# EAGLE schematic basic differential sensor (EAGLE 5.03)
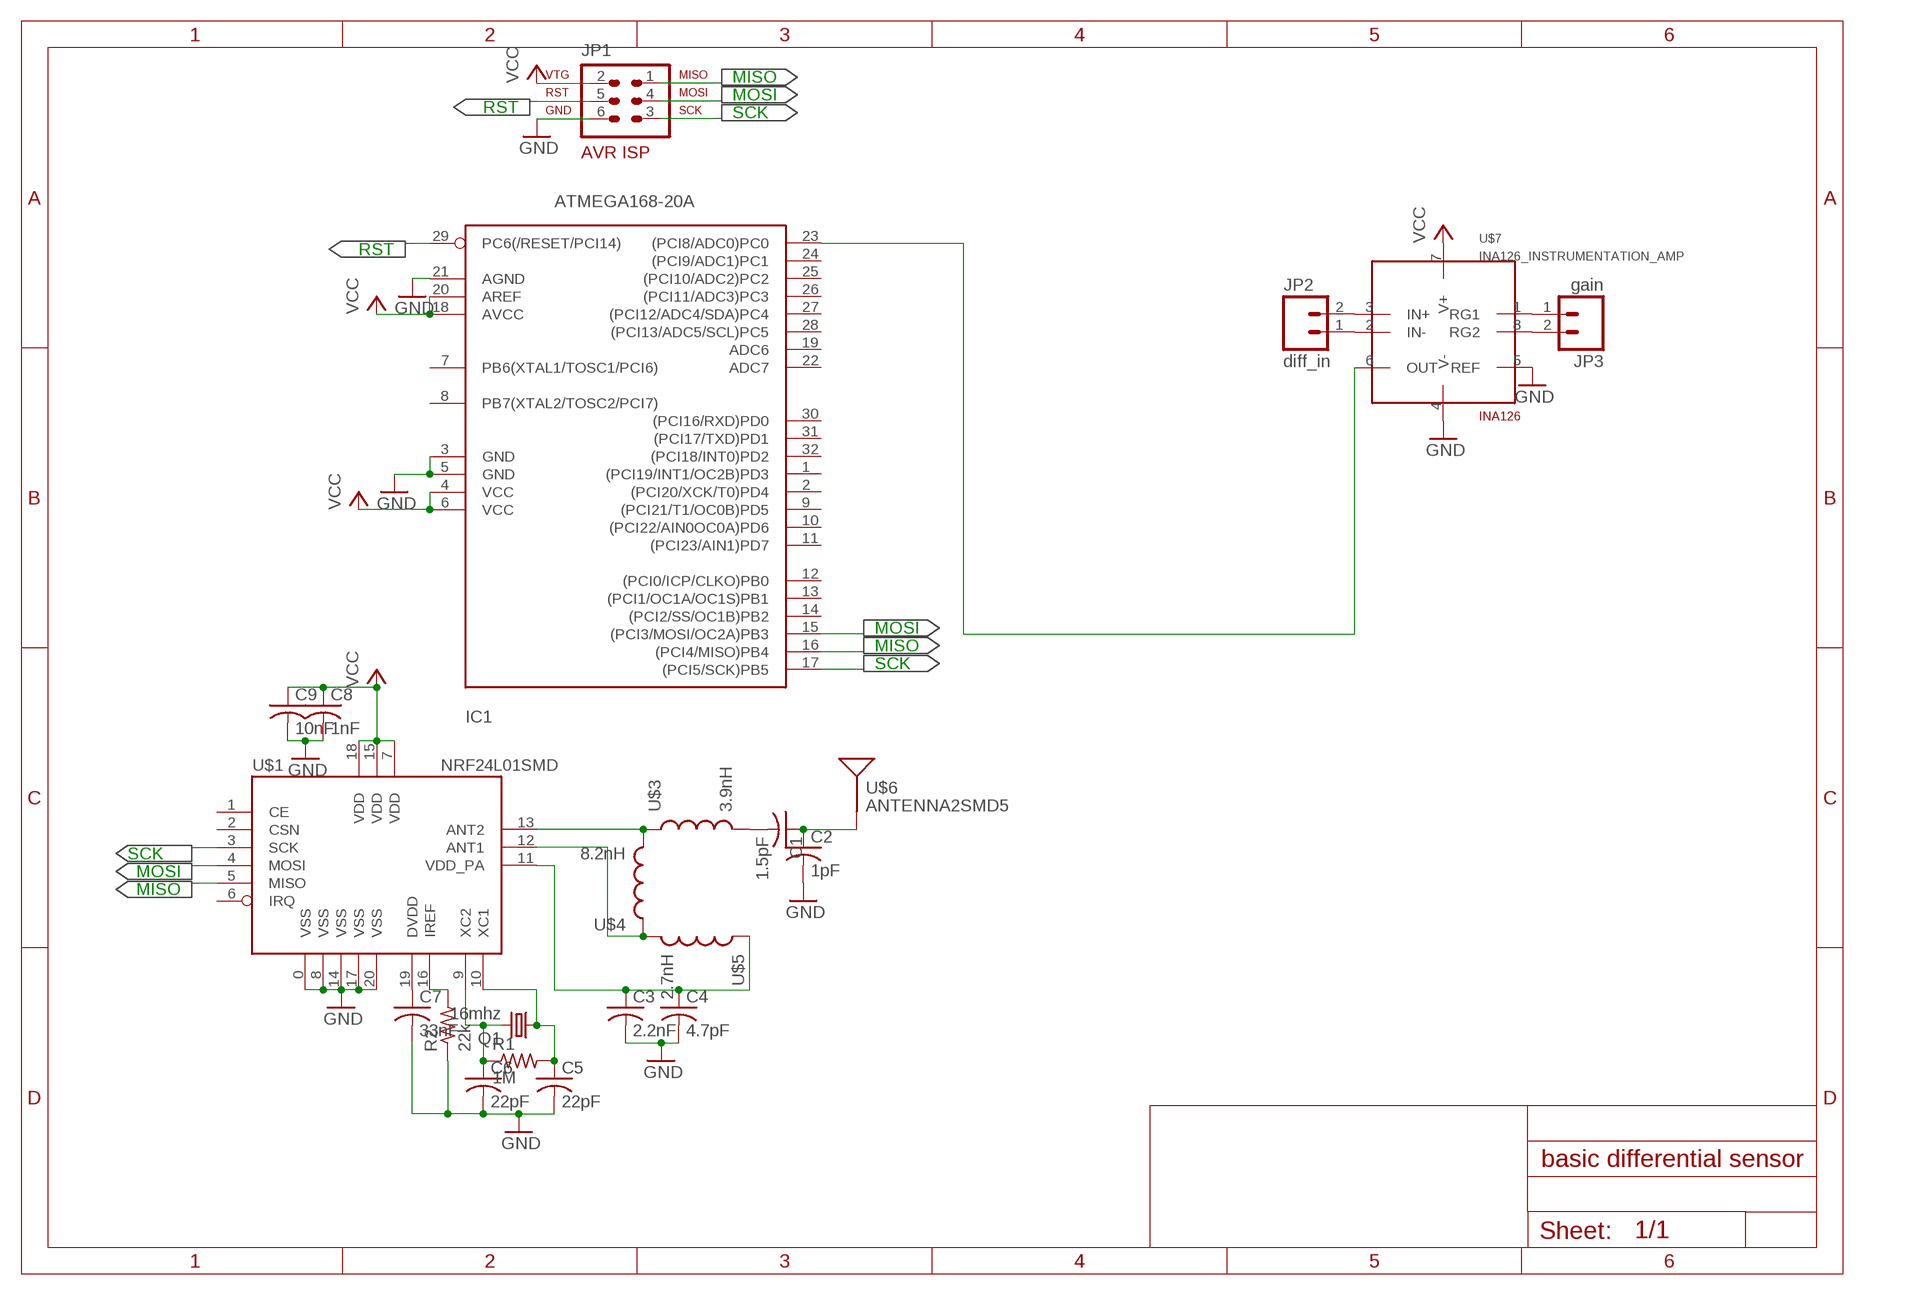
[diagram p0: schematic, sheet 1]

## Parts
C1  1.5pF  C-USC0402  [C0402]
C2  1pF  C-USC0402  [C0402]
C3  2.2nF  C-USC0402  [C0402]
C4  4.7pF  C-USC0402  [C0402]
C5  22pF  C-USC0603  [C0603]
C6  22pF  C-USC0603  [C0603]
C7  33nF  C-USC0402  [C0402]
C8  1nF  C-USC0402  [C0402]
C9  10nF  C-USC0402  [C0402]
IC1  ATMEGA168-20A  [TQFP32-08]
JP1  AVR-ISP-6  [AVR-ISP-6]
JP2  diff_in  M023.5MM  [SCREWTERMINAL-3.5MM-2]
JP3  gain  M023.5MM  [SCREWTERMINAL-3.5MM-2]
Q1  16mhz  CRYSTAL5X3  [CRYSTAL-SMD-5X3]
R1  1M  R-US_R0402  [R0402]
R2  22k  R-US_R0402  [R0402]
U$1  NRF24L01SMD  [QFN20]
U$3  3.9nH  INDUCTOR0402  [C0402]
U$4  8.2nH  INDUCTOR0402  [C0402]
U$5  2.7nH  INDUCTOR0402  [C0402]
U$6  ANTENNA2SMD5  [ANTENNA-CHIP5]
U$7  INA126_INSTRUMENTATION_AMP  [SO8]

## Nets
GND: C2.2 C3.2 C4.2 C5.2 C6.2 C7.2 C8.2 C9.2 IC1.3(GND) IC1.5(GND) IC1.21(AGND) JP1.6 R2.1 U$1.0(VSS) U$1.8(VSS) U$1.14(VSS) U$1.17(VSS) U$1.20(VSS) U$7.4(V-) U$7.5(REF)
MISO: IC1.16((PCI4/MISO)PB4) JP1.1
MOSI: IC1.15((PCI3/MOSI/OC2A)PB3) JP1.4
N$1: U$1.5(MISO)
N$2: U$1.4(MOSI)
N$3: U$1.3(SCK)
N$4: U$1.13(ANT2) U$3.1 U$4.2
N$5: U$1.12(ANT1) U$4.1 U$5.2
N$6: C1.2 U$3.2
N$7: C1.1 C2.1 U$6.FEED(SIGNAL)
N$8: C3.1 C4.1 U$1.11(VDD_PA) U$5.1
N$9: C5.1 Q1.1 R1.2 U$1.10(XC1)
N$10: C6.1 Q1.3 R1.1 U$1.9(XC2)
N$11: C7.1 U$1.19(DVDD)
N$12: R2.2 U$1.16(IREF)
N$13: JP2.1 U$7.2(IN-)
N$14: JP2.2 U$7.3(IN+)
N$15: IC1.23((PCI8/ADC0)PC0) U$7.6(OUT)
N$16: JP3.1 U$7.1(RG1)
N$17: JP3.2 U$7.8(RG2)
RST: IC1.29(PC6(/RESET/PCI14)) JP1.5
SCK: IC1.17((PCI5/SCK)PB5) JP1.3
VCC: C8.1 C9.1 IC1.4(VCC) IC1.6(VCC) IC1.18(AVCC) IC1.20(AREF) JP1.2 U$1.7(VDD) U$1.15(VDD) U$1.18(VDD) U$7.7(V+)
Unconnected: IC1.1((PCI19/INT1/OC2B)PD3) IC1.2((PCI20/XCK/T0)PD4) IC1.7(PB6(XTAL1/TOSC1/PCI6)) IC1.8(PB7(XTAL2/TOSC2/PCI7)) IC1.9((PCI21/T1/OC0B)PD5) IC1.10((PCI22/AIN0OC0A)PD6) IC1.11((PCI23/AIN1)PD7) IC1.12((PCI0/ICP/CLKO)PB0) IC1.13((PCI1/OC1A/OC1S)PB1) IC1.14((PCI2/SS/OC1B)PB2) IC1.19(ADC6) IC1.22(ADC7) IC1.24((PCI9/ADC1)PC1) IC1.25((PCI10/ADC2)PC2) IC1.26((PCI11/ADC3)PC3) IC1.27((PCI12/ADC4/SDA)PC4) IC1.28((PCI13/ADC5/SCL)PC5) IC1.30((PCI16/RXD)PD0) IC1.31((PCI17/TXD)PD1) IC1.32((PCI18/INT0)PD2) U$1.1(CE) U$1.2(CSN) U$1.6(IRQ)

## Notes on the sheet
- MISO
- RST | MOSI
- SCK
- RST
- MOSI
- MISO
- SCK
- SCK
- MOSI
- MISO

## Library data of the parts
C1-C9 = rcl:C-US: CAPACITOR, American symbol
IC1 = avr:ATMEGA168: MICROCONTROLLER 16 kBytes FLASH 1 kBytes SRAM 512 Bytes EEPROM USART 8-channel 10 bit ADC
JP1 = atmel-1:AVR-ISP-6: AVR ISP-6 Serial Programming Header
JP2 JP3 = SparkFun:M02: Header 2 Standard 2-pin 0.1" header. Use with straight break away headers (SKU : PRT-00116), right angle break away headers (PRT-00553), swiss pins (PRT-00743), machine pins (PRT-00117), and female headers (PRT-00115). Molex polarized connector foot print use with SKU : PRT-08233 with associated crimp pins and housings.
Q1 = SparkFun:CRYSTAL: Crystals Various standard crystals. Proven footprints. Spark Fun Electronics SKU : COM-00534
R1 R2 = rcl:R-US_: RESISTOR, American symbol
U$1 = SparkFun:NRF24L01: 2.4GHz Low Power Transceiver This is the very popular, low cost, very low power RF transceiver from Nordic Semiconductor. Simple SPI interface. SKU: COM-00690
U$3-U$5 = SparkFun:INDUCTOR: Inductors Basic Inductor/Choke - 0603 and 1206. Footprints are not proven and vary greatly between part numbers.
U$6 = SparkFun:ANTENNA2: Antenna Single endded antenna. Common with smaller chip antennas. CHIP4 package is the GPS Chip Antenna SKU: GPS-08418. CHIP5 package is 2.4GHz chip antenna SKU: WRL-00144.
U$7 = nublabs:INA126_INSTRUMENTATION_AMP: INA126 is a low-power instrumentation amplifier. Gain is set by Rg @ 5+80k/Rg